# Altium schematic sheet senocore.SchDoc
size A3
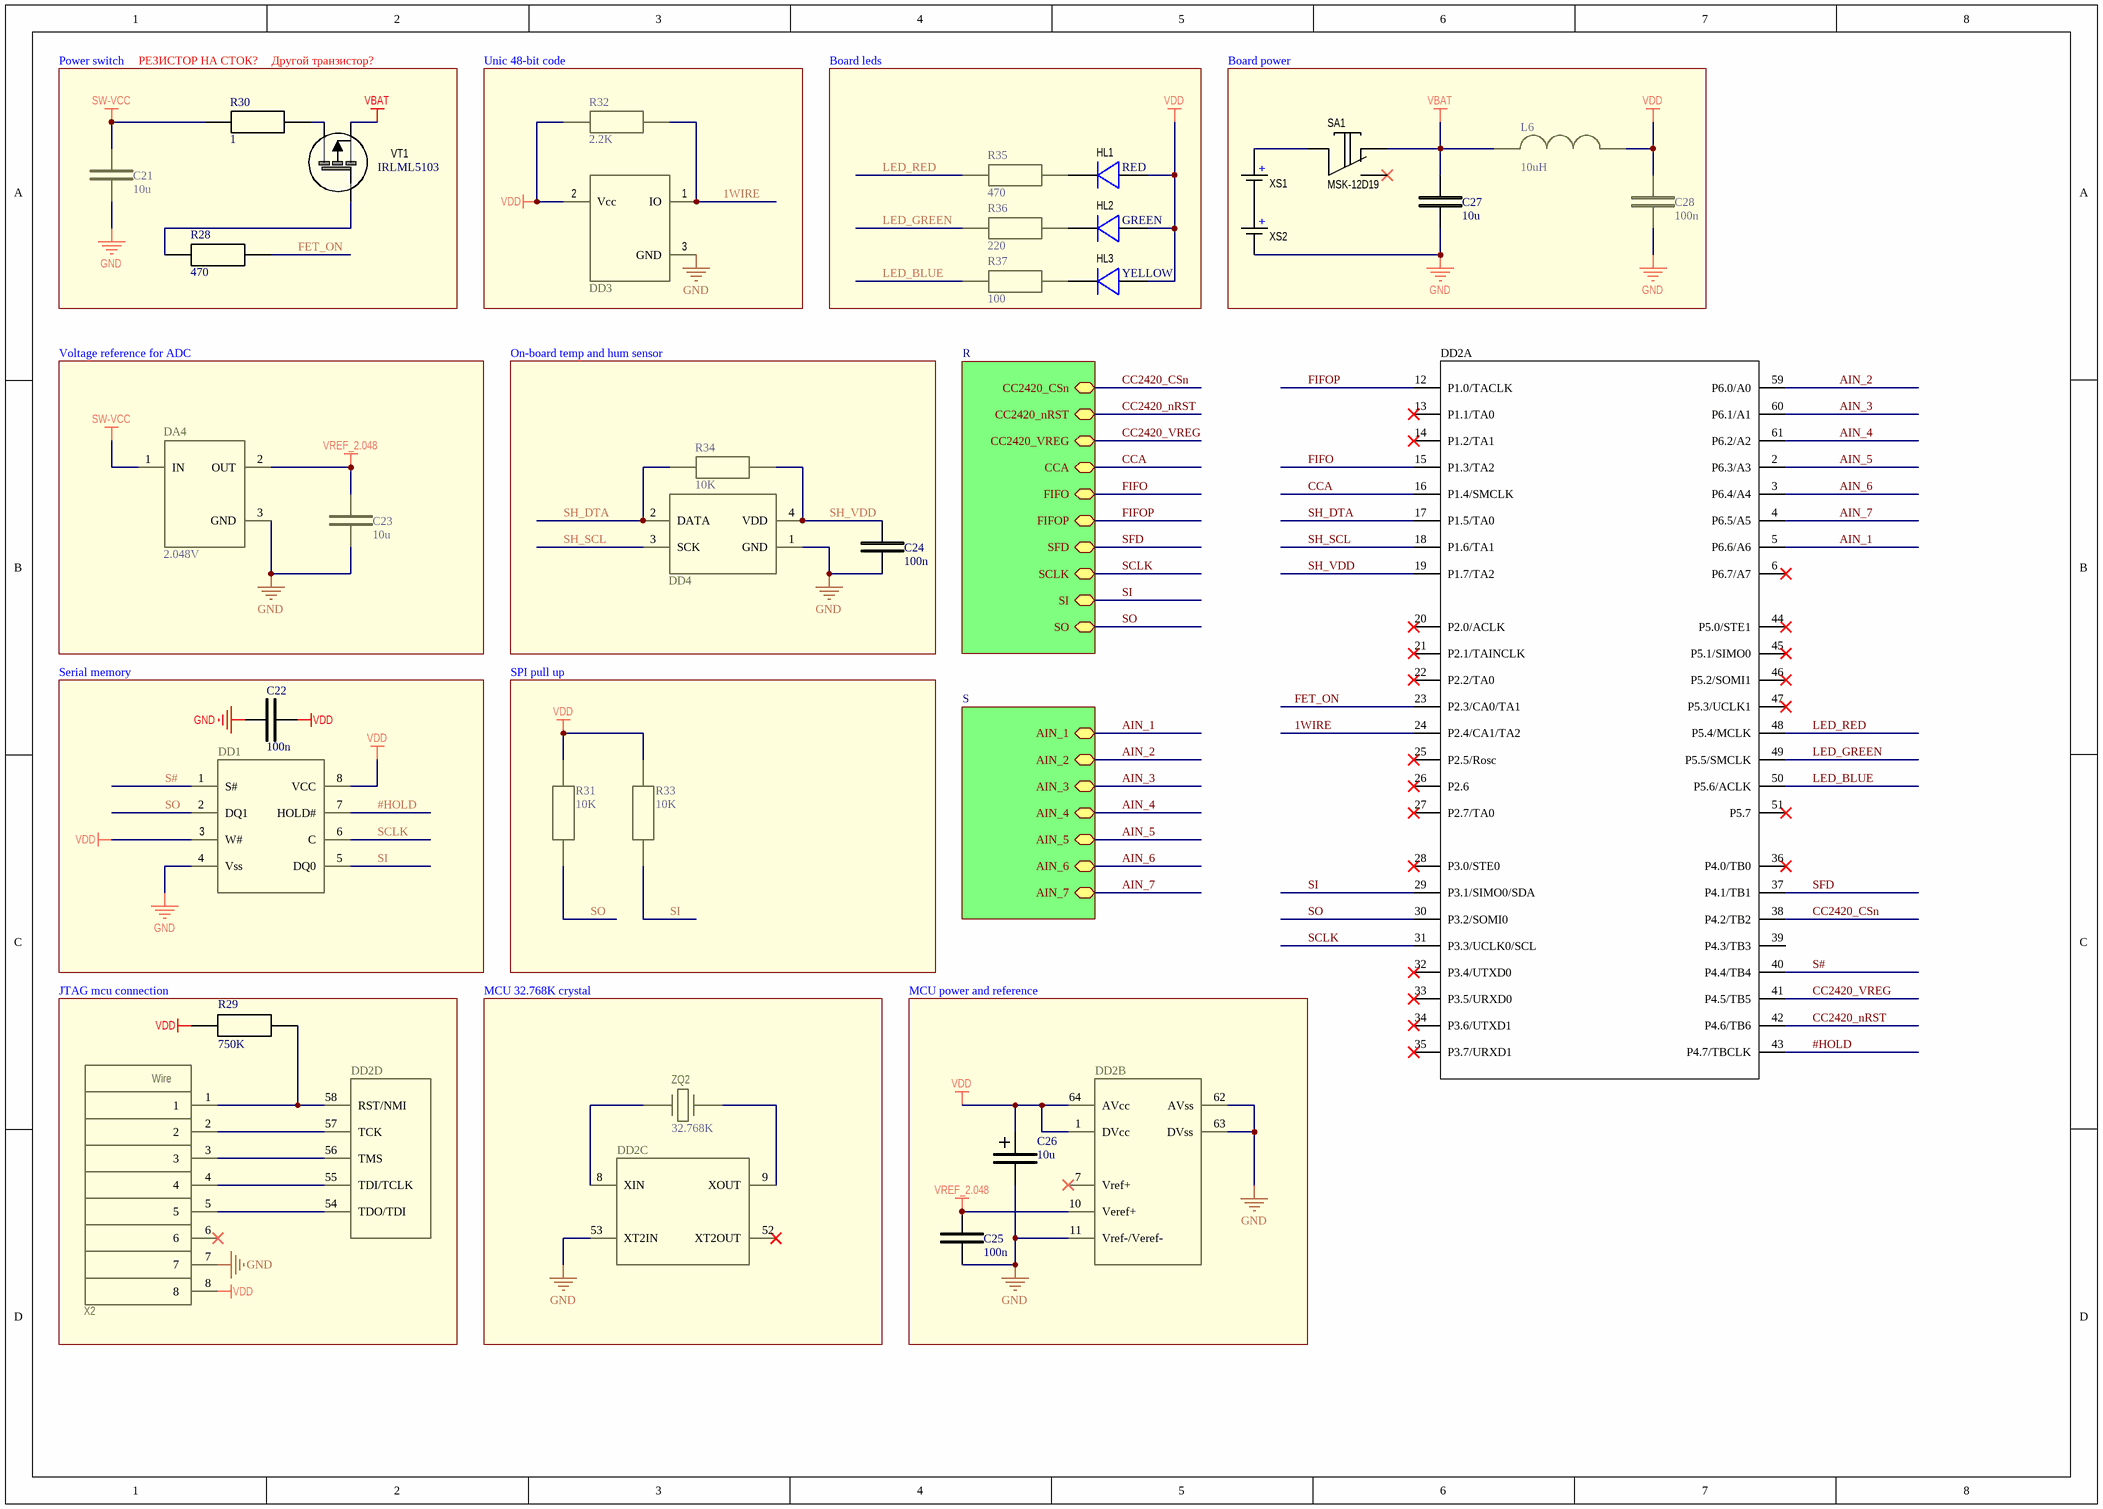
[diagram p0: senocore.SchDoc]

## Parts
C21  10u  [CAP0805]
C22  100n  [CAP0402]
C23  10u  [CAP0805]
C24  100n  [CAP0402]
C25  100n  [CAP0402]
C26  10u  [CapSMDA]
C27  10u  [CAP0805]
C28  100n  [CAP0402]
DA4  2.048V  [SC70-3]
DD1  M25P80V6  [So-8W]  (value not drawn)
DD2  M430F1611  [LQFP-64]  (value not drawn)  (parts A,B,C,D of 4)
DD3  DS2411  [SOT-23-3]  (value not drawn)
DD4  SHT10  [SHT1x]  (value not drawn)
HL1  RED  [LED RED TH L-1394IDT]
HL2  GREEN  [LED GREEN TH L-1394GDT]
HL3  YELLOW  [LED YELLOW TH L-1394YDT]
L6  10uH  [IND0805]
R28  470  [RES0402]
R29  750K  [RES0402]
R30  1  [RES0402]
R31  10K  [RES0402]
R32  2.2K  [RES0402]
R33  10K  [RES0402]
R34  10K  [RES0402]
R35  470  [RES0402]
R36  220  [RES0402]
R37  100  [RES0402]
SA1  MSK-12D19  [MSK-12D19 SPDT]
VT1  IRLML5103  [SOT-23-3]
X2  DS-1026-06 2X4  [PBD2-8 2mm]  (value not drawn)
XS1  Keystone AA Battery Clip  [KEYSTONE AA CLIPS]  (value not drawn)
XS2  Keystone AA Battery Clip  [KEYSTONE AA CLIPS]  (value not drawn)
ZQ2  32.768K  [DT-26]

## Blocks framed on the sheet
Unic 48-bit code: DD3 R32
Board leds: HL1-HL3 R35-R37
Board power: C27 C28 L6 SA1 XS1 XS2
Voltage reference for ADC: C23 DA4
On-board temp and hum sensor: C24 DD4 R34
Serial memory: C22 DD1
SPI pull up: R31 R33
JTAG mcu connection: DD2 R29 X2
MCU 32.768K crystal: DD2 ZQ2
MCU power and reference: C25 C26 DD2

## Sub-sheets
R = radio.SchDoc: CC2420_CSn, CC2420_nRST, CC2420_VREG, CCA, FIFO, FIFOP, SCLK, SFD, SI, SO
S = NTC connector.SchDoc: AIN_1, AIN_2, AIN_3, AIN_4, AIN_5, AIN_6, AIN_7

## Nets
GND: C21.2 C22.1 C23.2 C24.2 C25.2 C26.2 C27.2 C28.2 DA4.3(GND) DD1.4(Vss) DD2.11(Vref-/Veref-) DD2.53(XT2IN) DD2.62(AVss) DD2.63(DVss) DD3.3(GND) DD4.1(GND) X2.7 XS2.2
SW-VCC: C21.1 DA4.1(IN) R30.2
VBAT: C27.1 L6.1 SA1.1 VT1.2
VDD: C22.2 C26.1 C28.1 DD1.3(W#) DD1.8(VCC) DD2.1(DVcc) DD2.64(AVcc) DD3.2(Vcc) HL1.1(Anode) HL2.1(Anode) HL3.1(Anode) L6.2 R29.2 R31.1 R32.2 R33.1 X2.8
VREF_2.048: C23.1 C25.1 DA4.2(OUT) DD2.10(Veref+)
1WIRE: DD2.24(P2.4/CA1/TA2) DD3.1(IO) R32.1
#HOLD: DD1.7(HOLD#) DD2.43(P4.7/TBCLK)
AIN_1: DD2.5(P6.6/A6) ; sheet S/AIN_1
AIN_2: DD2.59(P6.0/A0) ; sheet S/AIN_2
AIN_3: DD2.60(P6.1/A1) ; sheet S/AIN_3
AIN_4: DD2.61(P6.2/A2) ; sheet S/AIN_4
AIN_5: DD2.2(P6.3/A3) ; sheet S/AIN_5
AIN_6: DD2.3(P6.4/A4) ; sheet S/AIN_6
AIN_7: DD2.4(P6.5/A5) ; sheet S/AIN_7
CC2420_CSn: DD2.38(P4.2/TB2) ; sheet R/CC2420_CSn
CC2420_nRST: DD2.42(P4.6/TB6) ; sheet R/CC2420_nRST
CC2420_VREG: DD2.41(P4.5/TB5) ; sheet R/CC2420_VREG
CCA: DD2.16(P1.4/SMCLK) ; sheet R/CCA
FET_ON: DD2.23(P2.3/CA0/TA1) R28.1
FIFO: DD2.15(P1.3/TA2) ; sheet R/FIFO
FIFOP: DD2.12(P1.0/TACLK) ; sheet R/FIFOP
LED_BLUE: DD2.50(P5.6/ACLK) R37.2
LED_GREEN: DD2.49(P5.5/SMCLK) R36.2
LED_RED: DD2.48(P5.4/MCLK) R35.2
S#: DD1.1(S#) DD2.40(P4.4/TB4)
SCLK: DD1.6(C) DD2.31(P3.3/UCLK0/SCL) ; sheet R/SCLK
SFD: DD2.37(P4.1/TB1) ; sheet R/SFD
SH_DTA: DD2.17(P1.5/TA0) DD4.2(DATA) R34.2
SH_SCL: DD2.18(P1.6/TA1) DD4.3(SCK)
SH_VDD: C24.1 DD2.19(P1.7/TA2) DD4.4(VDD) R34.1
SI: DD1.5(DQ0) DD2.29(P3.1/SIMO0/SDA) R33.2 ; sheet R/SI
SO: DD1.2(DQ1) DD2.30(P3.2/SOMI0) R31.2 ; sheet R/SO
NetDD2_8: DD2.8(XIN) ZQ2.1
NetDD2_9: DD2.9(XOUT) ZQ2.2
NetDD2_54: DD2.54(TDO/TDI) X2.5
NetDD2_55: DD2.55(TDI/TCLK) X2.4
NetDD2_56: DD2.56(TMS) X2.3
NetDD2_57: DD2.57(TCK) X2.2
NetDD2_58: DD2.58(RST/NMI) R29.1 X2.1
NetHL1_2: HL1.2(Cathode) R35.1
NetHL2_2: HL2.2(Cathode) R36.1
NetHL3_2: HL3.2(Cathode) R37.1
NetR28_2: R28.2 VT1.1
NetR30_1: R30.1 VT1.3
NetSA1_2: SA1.2 XS1.1(+)
NetXS1_2: XS1.2 XS2.1(+)

Not connected (* = marked no-connect by the designer): DD2 6(P6.7/A7)* 7(Vref+)* 13(P1.1/TA0)* 14(P1.2/TA1)* 20(P2.0/ACLK)* 21(P2.1/TAINCLK)* 22(P2.2/TA0)* 25(P2.5/Rosc)* 26(P2.6)* 27(P2.7/TA0)* 28(P3.0/STE0)* 32(P3.4/UTXD0)* 33(P3.5/URXD0)* 34(P3.6/UTXD1)* 35(P3.7/URXD1)* 36(P4.0/TB0)* 39(P4.3/TB3) 44(P5.0/STE1)* 45(P5.1/SIMO0)* 46(P5.2/SOMI1)* 47(P5.3/UCLK1)* 51(P5.7)* 52(XT2OUT)*; SA1 3*; X2 6*

## Notes on the sheet
- Power switch
- (near R30) РЕЗИСТОР НА СТОК?
- (near R30) Другой транзистор?
- (in symbol PBD2-8 step 2mm) Wire

## Library data of the parts
C21 C23 C27 = 10u SMD 0805: 0805 SMD; PartNumber: CL21A106KPFNNNG; Manufacturer: Samsung; Supplier: Terraelectronica; Unit Price: 1.2; WebLink: https://www.terraelectronica.ru/product/984943
C22 C24 C25 C28 = 100n SMD 0402: 0402 SMD; PartNumber: CC0402ZRY5V7BB104; Manufacturer: Yageo; Supplier: Terraelectronica; Unit Price: 0.22; WebLink: https://www.terraelectronica.ru/product/543093
C26 = 10u SMD TYPE A: SMD TYPE A; PartNumber: T491A106K010AT; Manufacturer: Kemet; Supplier: Terraelectronica; Unit Price: 5; WebLink: https://www.terraelectronica.ru/product/556976
DA4 = REF3320: Reference 2.048V; PartNumber: REF3318AIDCKR, REF3318AIDCKT; Manufacturer: Texas Instruments; Supplier: Terrraelectronica; Unit Price: 67; WebLink: https://www.terraelectronica.ru/catalog/istochniki-opornogo-napryazheniya-i-toka-256?text=ref3320&search=ref3320
DD1 = M25P80V6: Serial memory 2.7-3.6V, 8 Mbit (1 Mbyte); PartNumber: M25P80-VMW; Manufacturer: Micron; Supplier: Chipdip; Unit Price: 130; WebLink: https://www.chipdip.ru/product1/8344124196
DD2 = M430F1611: MCU; PartNumber: MSP430F1611IPM; Manufacturer: Texas Instruments; Supplier: Terraelectronica; Unit Price: 1480; WebLink: https://www.terraelectronica.ru/product/67958
DD3 = DS2411: Unic 48bit serial code. Family code 0x01; PartNumber: DS2411R+T&R; Manufacturer: Maxim; Supplier: Chipdip; Unit Price: 130; WebLink: https://www.chipdip.ru/product/ds2411r-t-r-2
DD4 = SHT10: Temp and hum sensor; Manufacturer: Sensirion; PartNumber: SHT10; Supplier: Terraelectronica; Unit Price: 998; WebLink: https://www.terraelectronica.ru/product/325109
HL1 = LED Flat top RED TH 3.4mm/2mm: 10 mA, V=2.5 V; PartNumber: GNL-3012HD; Manufacturer: G-nor Electronics; Supplier: Chipdip; Unit Price: 8; WebLink: https://www.chipdip.ru/product/gnl-3012hd
HL2 = LED Flat top GREEN TH 3.4mm/2mm: 10 mA, V=2.5 V; PartNumber: GNL-3012GD; Manufacturer: G-nor Electronics; Supplier: Chipdip; Unit Price: 8; WebLink: https://www.chipdip.ru/product/gnl-3012gd
HL3 = LED Flat top YELLOW TH 3.4mm/2mm: 10 mA, V=2.5 V; PartNumber: GNL-3012YD; Manufacturer: G-nor Electronics; Supplier: Chipdip; Unit Price: 8; WebLink: https://www.chipdip.ru/product/gnl-3012yd
L6 = IND 10uH SMD 0805: 0805 SMD; PartNumber: LQM21FN100M80L; Manufacturer: Murata; Supplier: Terraelectronica; Unit Price: 4.4; WebLink: https://www.terraelectronica.ru/product/1496283
R28 R35 = 470R 1% SMD 0402: 1% 0402 SMD 0.063W; PartNumber: RC0402FR-07470RL; Manufacturer: Yageo; Supplier: Terraelectronica; Unit Price: 0.1; WebLink: https://www.terraelectronica.ru/product/870778
R29 = 750K 1% SMD 0402: 1% 0402 SMD 0.063W; PartNumber: RC0402FR-07750KL; Manufacturer: Yageo; Supplier: Terraelectronica; Unit Price: 0.1; WebLink: https://www.terraelectronica.ru/product/870851
R30 = 1R 1% SMD 0402: 1% 0402 SMD 0.063W; PartNumber: RC0402FR-071RL; Manufacturer: Yageo; Supplier: Terraelectronica; Unit Price: 0.1; WebLink: https://www.terraelectronica.ru/product/870639
R31 R33 R34 = 10K 1% SMD 0402: 1% 0402 SMD 0.063W; PartNumber: RC0402FR-0710KL; Manufacturer: Yageo; Supplier: Terraelectronica; Unit Price: 0.1; WebLink: tps://www.terraelectronica.ru/product/358779
R32 = 2.2K 1% SMD 0402: 1% 0402 SMD 0.063W; PartNumber: RC0402FR-072K2L; Manufacturer: Yageo; Supplier: Terraelectronica; Unit Price: 0.11; WebLink: https://www.terraelectronica.ru/product/560314
R36 = 220R 1% SMD 0402: 1% 0402 SMD 0.063W; PartNumber: RC0402FR-07220RL; Manufacturer: Yageo; Supplier: Terraelectronica; Unit Price: 0.1; WebLink: https://www.terraelectronica.ru/product/870650
R37 = 100R 1% SMD 0402: 1% 0402 SMD 0.063W; PartNumber: RC0402FR-07100RL; Manufacturer: Yageo; Supplier: Terraelectronica; Unit Price: 0.11; WebLink: https://www.terraelectronica.ru/product/361823
SA1 = SPD 3 pin MSK-12D19: Slide switch 3 pin; Manufacturer: Shenzhen Intech Electronic; WebLink: http://www.intechswitch.com/products/SideKnobToggleslideswitchseries/641.html; Unit Price: 20; PartNumber: MSK-12D19
VT1 = IRLML5103: p-mosfet   -30V 0.76A Vgs=-1V; PartNumber: IRLML5103TRPBF; Manufacturer: International Rectifier; Supplier: Chipdip; Unit Price: 9; WebLink: https://www.chipdip.ru/product/irlml5103tr
X2 = PBD2-8 step 2mm: Step 2mm 2x4 height 4.3mm; PartNumber: DS1026-06-2*4S8BV; Manufacturer: Ningbo connfly electronic; Supplier: Chipdip; Unit Price: 11; WebLink: https://www.chipdip.ru/product/pbd2-8
XS1 XS2 = Keystone AA Battery Clip: Button Contact; PartNumber: 92; WebLink: https://www.keyelco.com/category.cfm/Cylindrical-Cell-Clips-THM-and-SMT/AA-CR2-Battery-Clips-and-Contacts/id/945; Manufacturer: Keystone
ZQ2 = ZQ 32.768K 12.5pF 20ppm: Load 12.5pF 20ppm; PartNumber: 32768Hz(2x6mm); Manufacturer: China; Supplier: Chipdip; Unit Price: 12; WebLink: https://www.chipdip.ru/product/32768hz-2x6mm